# Altium schematic sheet RPi Stepper Hat V1.1.SchDoc: Raspberry Pi Stepper Motor Driver Board
size A3; SheetNumber: 1; SheetTotal: 1
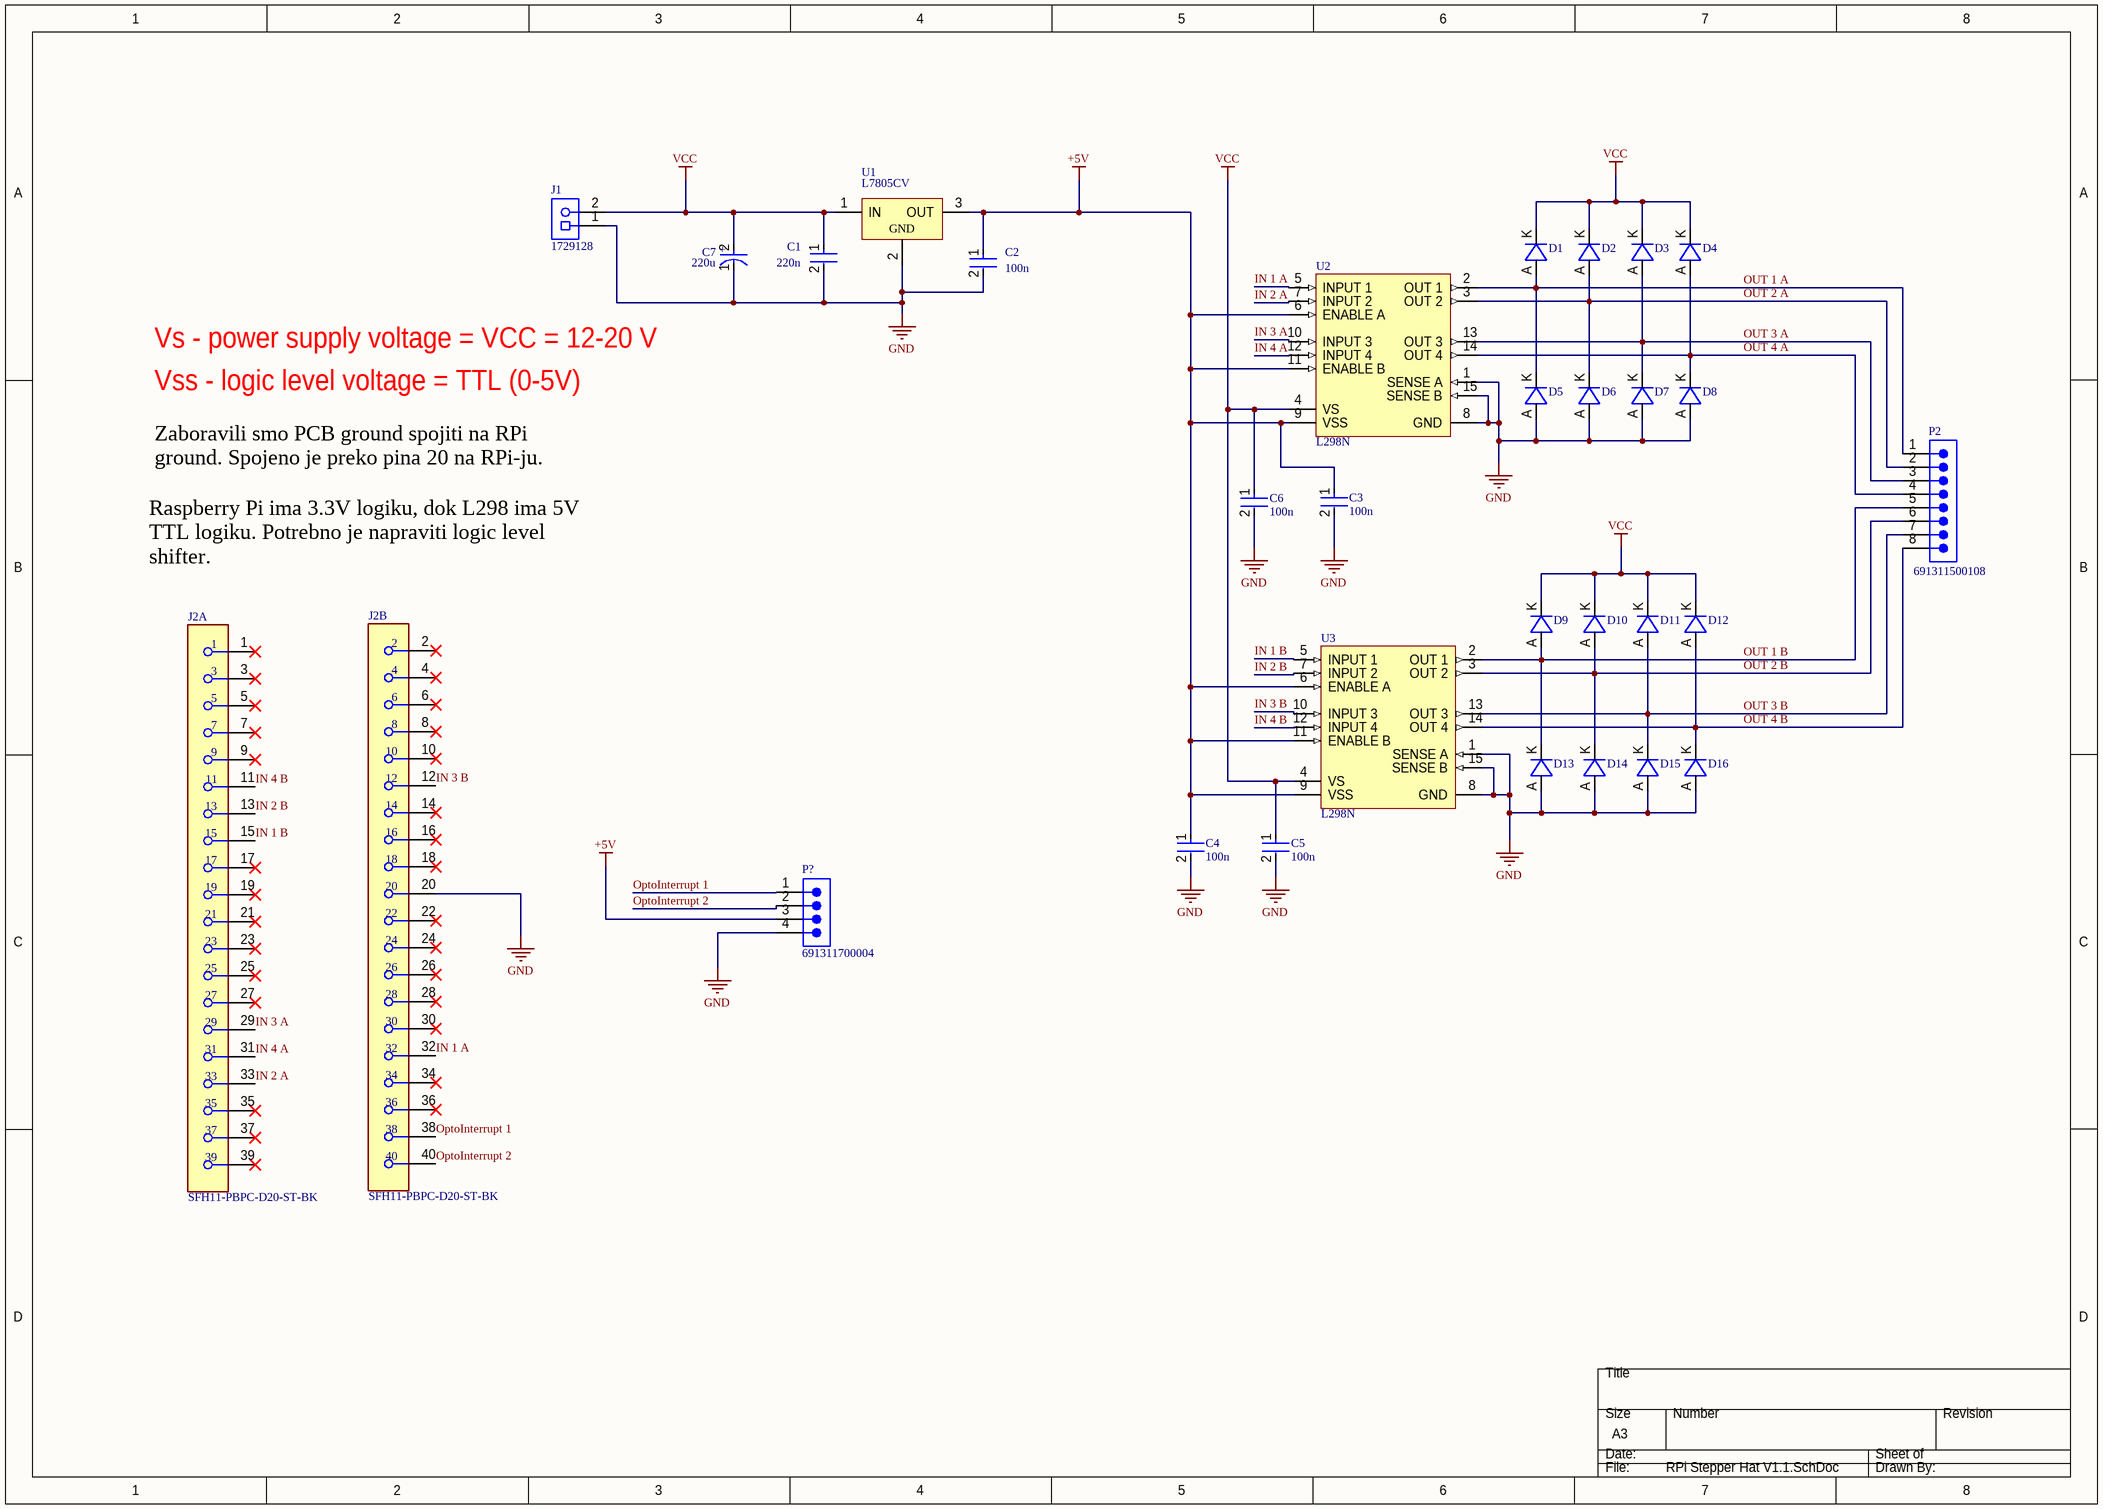
[diagram p0: RPi Stepper Hat V1.1.SchDoc]

## Parts
C1  220n  [FP-RCE1K1-2_5-MFG]
C2  100n  [FP-RDE0P1-MFG]
C3  100n  [FP-RDE0P1-MFG]
C4  100n  [FP-RDE0P1-MFG]
C5  100n  [FP-RDE0P1-MFG]
C6  100n  [FP-RDE0P1-MFG]
C7  220u  [FP-RAD-TH-D_10_0_5-L_25_2-MFG]
D1  RFN2VWM2STR  [DIOM4326X24N]  (value not drawn)
D2  RFN2VWM2STR  [DIOM4326X24N]  (value not drawn)
D3  RFN2VWM2STR  [DIOM4326X24N]  (value not drawn)
D4  RFN2VWM2STR  [DIOM4326X24N]  (value not drawn)
D5  RFN2VWM2STR  [DIOM4326X24N]  (value not drawn)
D6  RFN2VWM2STR  [DIOM4326X24N]  (value not drawn)
D7  RFN2VWM2STR  [DIOM4326X24N]  (value not drawn)
D8  RFN2VWM2STR  [DIOM4326X24N]  (value not drawn)
D9  RFN2VWM2STR  [DIOM4326X24N]  (value not drawn)
D10  RFN2VWM2STR  [DIOM4326X24N]  (value not drawn)
D11  RFN2VWM2STR  [DIOM4326X24N]  (value not drawn)
D12  RFN2VWM2STR  [DIOM4326X24N]  (value not drawn)
D13  RFN2VWM2STR  [DIOM4326X24N]  (value not drawn)
D14  RFN2VWM2STR  [DIOM4326X24N]  (value not drawn)
D15  RFN2VWM2STR  [DIOM4326X24N]  (value not drawn)
D16  RFN2VWM2STR  [DIOM4326X24N]  (value not drawn)
J1  1729128  [PHOE-1729128-2_V]
J2  SFH11-PBPC-D20-ST-BK  [FP-SFH11-PBPC-D20-ST-BK-MFG]  (parts A,B of 2)
P2  691311500108  [691311500108]
P?  691311700004  [691311700004]
U1  L7805CV  [TO220]
U2  L298N  [STM-FM-15]
U3  L298N  [STM-FM-15]

## Nets
+5V: C2.1 C3.1 C4.1 P?.3 U1.3(OUT) U2.6(ENABLE_A) U2.9(VSS) U2.11(ENABLE_B) U3.6(ENABLE_A) U3.9(VSS) U3.11(ENABLE_B)
GND: C1.2 C2.2 C3.2 C4.2 C5.2 C6.2 C7.1(C) D5.A(anode) D6.A(anode) D7.A(anode) D8.A(anode) D13.A(anode) D14.A(anode) D15.A(anode) D16.A(anode) J1.1 J2.20 P?.4 U1.2(GND) U2.1(SENSE_A) U2.8(GND) U2.15(SENSE_B) U3.1(SENSE_A) U3.8(GND) U3.15(SENSE_B)
VCC: C1.1 C5.1 C6.1 C7.2(A) D1.K(cathode) D2.K(cathode) D3.K(cathode) D4.K(cathode) D9.K(cathode) D10.K(cathode) D11.K(cathode) D12.K(cathode) J1.2 U1.1(IN) U2.4(VS) U3.4(VS)
IN 1 A: J2.32 U2.5(INPUT_1)
IN 1 B: J2.15 U3.5(INPUT_1)
IN 2 A: J2.33 U2.7(INPUT_2)
IN 2 B: J2.13 U3.7(INPUT_2)
IN 3 A: J2.29 U2.10(INPUT_3)
IN 3 B: J2.12 U3.10(INPUT_3)
IN 4 A: J2.31 U2.12(INPUT_4)
IN 4 B: J2.11 U3.12(INPUT_4)
OptoInterrupt 1: J2.38 P?.1
OptoInterrupt 2: J2.40 P?.2
OUT 1 A: D1.A(anode) D5.K(cathode) P2.1 U2.2(OUT_1)
OUT 1 B: D9.A(anode) D13.K(cathode) P2.5 U3.2(OUT_1)
OUT 2 A: D2.A(anode) D6.K(cathode) P2.2 U2.3(OUT_2)
OUT 2 B: D10.A(anode) D14.K(cathode) P2.6 U3.3(OUT_2)
OUT 3 A: D3.A(anode) D7.K(cathode) P2.3 U2.13(OUT_3)
OUT 3 B: D11.A(anode) D15.K(cathode) P2.7 U3.13(OUT_3)
OUT 4 A: D4.A(anode) D8.K(cathode) P2.4 U2.14(OUT_4)
OUT 4 B: D12.A(anode) D16.K(cathode) P2.8 U3.14(OUT_4)

Not connected (* = marked no-connect by the designer): J2 1* 2* 3* 4* 5* 6* 7* 8* 9* 10* 14* 16* 17* 18* 19* 21* 22* 23* 24* 25* 26* 27* 28* 30* 34* 35* 36* 37* 39*

## Notes on the sheet
- Vs - power supply voltage = VCC = 12-20 V
- Vss - logic level voltage = TTL (0-5V)
- Zaboravili smo PCB ground spojiti na RPi ground. Spojeno je preko pina 20 na RPi-ju.
- Raspberry Pi ima 3.3V logiku, dok L298 ima 5V TTL logiku. Potrebno je napraviti logic level shifter.
- (in symbol CMP-05427-000604-1) +

## Library data of the parts
C1 = CMP-06035-036150-1: Cap Ceramic Monolithic 220nF 50V 10% Thru-Hole Bulk RCER71H224K1M1H03A; Lead Diameter: 0.5mm; Lead/Base Style: Formed Leads; Dielectric: X7R; Capacitance: 220nF; Width: 0.098inch; Package Quantity: 1; Mount: Through Hole; Voltage Rating: 50V; Voltage Rating (DC): 50V; Height: 3.5mm; Tolerance: 10%; Height - Seated (Max): 0.138inch; Packaging: Tape and Reel; Termination: Radial; Ratings: AEC-Q200; Resistor Type: Ceramic; Lead Pitch: 0.197inch; Max Operating Temperature: 125°C; Min Operating Temperature: -55°C; Case/Package: Radial; Length: 0.157inch
C2-C6 = CMP-06035-046728-1: Ceramic Capacitor 100nF ±10% 25V X7R Radial RDER71E104K0S1H03A; Lead Diameter: 0.5mm; Termination: Radial; Min Operating Temperature: -55°C; Max Operating Temperature: 125°C; Height: 3.5mm; Mount: Through Hole; Voltage Rating (DC): 25V; Width: 3.5mm; Dielectric: X7R; Height - Seated (Max): 0.236inch; Voltage Rating: 25V; Length: 0.197inch; Lead Free: Lead Free; Lead Pitch: 0.098inch; Case/Package: Radial; Tolerance: 10%; Packaging: Tape and Reel; Capacitance: 100nF; Resistor Type: Ceramic; Package Quantity: 2000
C7 = CMP-05427-000604-1: Aluminum Electrolytic Capacitors (Radial Lead Type) 220uF ±20% 63V EEUFR1J221LB; Life (Hours): 10000Hour; Lead Diameter: 0.6mm; ESR (Equivalent Series Resistance): 33mR; Ripple Current: 1.5A; Polarity: Polar; Package Quantity: 500; Height - Seated (Max): 1.063inch; Mount: Through Hole; Termination: Radial; Tolerance: 20%; Lead Free: Lead Free; Voltage Rating (DC): 63V; Series: FR; Max Operating Temperature: 105°C; Length: 25mm; Capacitance: 220uF; Voltage Rating: 63V; REACH SVHC: Yes; Lead Pitch: 5mm; Min Operating Temperature: -40°C; Impedance: 33mR; Diameter: 10mm; Height: 25mm; Case/Package: Radial; Radiation Hardening: No; RoHS Compliant: Yes; Construction: Cylindrical; Packaging: Tape and Reel
J1 = CMP-2000-05815-1: PCB Terminal Block, 13.5 A, 400 V, 2-Pin THD, RoHS, Bulk; Manufacturer: Phoenix Contact; Package Version: 03/2015; No. of Rows: 1; Pitch: 5.08mm; No. of Positions: 2; Voltage Rating: 400V; Current Rating: 13500mA; Manufacturer URL: http://www.phoenixcontact.com/; Datasheet URL: https://datasheet.ciiva.com/16046/1729128-16046181.pdf; RoHS: TRUE; Package URL: https://www.phoenixcontact.com/online/portal/pi/pxc/product_detail_page/!ut/p/b1/3VdJjqNKFDxLH8AFycySyWY2ozFsEPOMMQaDOX1XedGL_1Vdm5YXJleknhSKeBkvI6EA8ncAo3AYoDhBQGco6KN7VURTdemj9us_IEKEZo_YHiPAEWEFmDGOHMORkqKYCORBZxgL7ZoaZYcbFFUZ3fqxSY6GOuxydWUuHqz1ynmMFygu583Bob0Ewr6Sd_l-5m-kAueHiB0jpRwZwe58wwtkpxtMYd_LmGcDRU02dRNEyWt6Y2ti5pSyJ_reIkzIulrqApdnbT11V5jnCKbYNCvhEM1MCpPByat_X379-iThf08CI5GfOPqfBeS3BRoBOdD55AKVv0iLwCMq-2BrzXWSGRH7pUGD9uwXQjiph3xL0DKQwdGa0JImiIOmBNOestqgwTHSSs2oOep-78apyXQBvNi8ZLaFjvjWvcaUEBu0MC6Wbe-d6mB0FAebo2lUWinqYaZs5DAYzV0RP9yitUjnGJ0iI9xhZkT42OCQNUJJhkgWINNQLP2JFP6OpMg3JCVg70jqHT0lvKOnhHf0lPuOnnLf0VPuWx6_dxwUIvwk5WMkT0kLL1mh61l2yZVSzG3pYV_bqo-mj6uMKwKwdnnW8Jh5RTOJzMOA5c-eJDaZQw4mTMPH02PvS_ZAqNVjVTo2WyYLkwH_KU1mmmG5kjRhDqPXLwwVHvVOjCM60-fpXvTDfMGW1PVFVS1r4e4yVDk4ZdNbkUHvqPqQSeian4UD39fNKmachqdJ1NJbyk8rXT9mXTvPk3oE5meulKGgiruPJek-4I9hTT6G8ZLOyRSm2RRVbThERQad5OS28hdt4YW4vG0stgYYzsWsK4_7y6DZMjJSCqri1kyiZR5vD7pwIrNR7QwPHTcLTI5qT7eRlpHrdGiupYlqQDJ7zy_CND8fWWBoLRXxk1RVcXiBQwbTD4Xi7KL-FuO94t9xaqweXzH; PartNumber: 1729128; Package Description: 2-Pin Through Hole Device, Body 8.1 x 10.16 mm, Pitch 5.08 mm; Datasheet Version: 12/2013; Mounting Technology: ThroughHole; Orientation: Horizontal; Package Reference: 1729128-2; Packing: Bulk
J2 = CMP-25680-000025-1: CONN HDR 40POS 0.1 GOLD PCB; Pitch: 0.1inch; Number of Positions: 40; Connector Type: Header; Color: Black; Mount: Through Hole; Number of Rows: 2; Contact Plating: Gold; Lead Free: Lead Free; Packaging: Tray; Row Spacing: 0.1inch; Termination: Solder; Package Quantity: 1
P2 = CMP-1502-02152-2: NexarPartId: 8917752; Pitch: 5.08mm; Current: 20A; Number of Positions Per Level: 8; Gender: Male; Number of Levels: 1; Voltage: 300V; Lead Pitch: 5.08mm; Packaging: Box; Number of Rows: 1; Contact Material: Brass; Height: 12mm; Contact Plating: Tin; RoHS: Compliant; Number of Pins: 8; Current Rating: 20A; Mount: Through Hole; Width: 42.64mm; Length: 8.5mm; Orientation: Vertical; REACH SVHC: No SVHC; Contact Gender: Male; Number of Contacts: 8; Color: Green; Termination: Solder
P? = CMP-1502-02028-2: NexarPartId: 18818306; Gender: Male; Number of Levels: 1; Voltage: 300V; Number of Contacts: 4; Connector Type: PCB, Terminal Block; Pitch: 5.0038mm; Current: 20A; Orientation: Vertical; Length: 8.5mm; Color: Green; Number of Pins: 4; RoHS: Compliant; REACH SVHC: Unknown; Width: 20mm; Lead Pitch: 5mm; Contact Material: Brass; Packaging: Box; Number of Positions Per Level: 4; Height: 12mm; Number of Rows: 1; Termination: Solder; Mount: Through Hole
U1 = CMP-0244-00483-1: Positive Voltage Regulator, 5V, 3-Pin TO-220; PackageDescription: TO, Thru-Hole, Vertical, Heatsink Mounted; 3 In-Line Leads; Pitch 2.54 mm; ComponentLink2Description: Datasheet; PackageReference: TO220; ComponentLink3URL: http://www.st.com/internet/com/TECHNICAL_RESOURCES/TECHNICAL_LITERATURE/PACKAGE_INFORMATION/CD00004649.pdf; DatasheetVersion: 16/11/2011; ComponentLink1Description: Manufacturer URL; ComponentLink1URL: http://www.st.com; PackageVersion: ver3.0; ComponentLink3Description: Package Specification; ComponentLink2URL: http://www.st.com/internet/com/TECHNICAL_RESOURCES/TECHNICAL_LITERATURE/DATASHEET/CD00000444.pdf
U2 U3 = CMP-2000-06526-1: Dual Full-Bridge Driver, 4.8 to 46 V, -40 to 150 degC, 15-Pin FM (MW 15L), RoHS, Tube; Manufacturer: STMicroelectronics; PartNumber: L298; Output Current: 2A; Supply Voltage Max: 7V; Driver Case Style: Multiwatt; Supply Voltage Min: 4.5V; No. of Pins: 15Pins; SVHC: NoSVHC(17-Dec-2015); Output Voltage: 46V; No. of Outputs: 4Outputs; Motor Type: FullBridge; MSL: -; Package Description: 15-Pin Flange Mount, Body 5 x 19.6 mm, Pitch 1.27 mm; Datasheet Version: 01/2000; Package Reference: FM-15; Mounting Technology: ThroughHole; Packaging: Each; Automotive Qualification Standard: -; Product Range: -; Datasheet URL: https://datasheet.ciiva.com/15109/getdatasheetpartid-50682-15109332.pdf; Operating Temperature Max: 130°C; Operating Temperature Min: -25°C; Manufacturer URL: http://www.st.com/